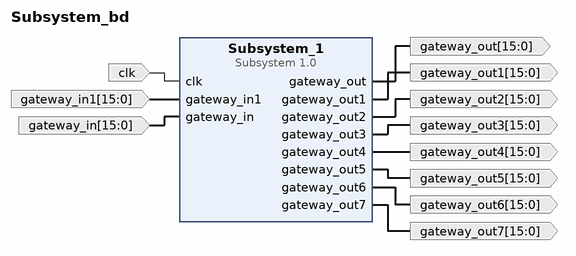
[diagram p0: block diagram of the top level]
# Vivado block design Subsystem_bd, xc7k160tfbg676-3, Vivado 2022.2
create_bd_design Subsystem_bd

create_bd_port -dir I -type clk clk
create_bd_port -dir I -from 15 -to 0 -type data gateway_in
create_bd_port -dir I -from 15 -to 0 -type data gateway_in1
create_bd_port -dir O -from 15 -to 0 -type data gateway_out
create_bd_port -dir O -from 15 -to 0 -type data gateway_out1
create_bd_port -dir O -from 15 -to 0 -type data gateway_out2
create_bd_port -dir O -from 15 -to 0 -type data gateway_out3
create_bd_port -dir O -from 15 -to 0 -type data gateway_out4
create_bd_port -dir O -from 15 -to 0 -type data gateway_out5
create_bd_port -dir O -from 15 -to 0 -type data gateway_out6
create_bd_port -dir O -from 15 -to 0 -type data gateway_out7

create_bd_cell -type ip -vlnv User_Company:VMC:Subsystem:1.0 Subsystem_1

# ---- connections ----

connect_bd_net [get_bd_pins Subsystem_1/gateway_out] [get_bd_ports gateway_out]
connect_bd_net [get_bd_pins Subsystem_1/gateway_out1] [get_bd_ports gateway_out1]
connect_bd_net [get_bd_pins Subsystem_1/gateway_out2] [get_bd_ports gateway_out2]
connect_bd_net [get_bd_pins Subsystem_1/gateway_out3] [get_bd_ports gateway_out3]
connect_bd_net [get_bd_pins Subsystem_1/gateway_out4] [get_bd_ports gateway_out4]
connect_bd_net [get_bd_pins Subsystem_1/gateway_out5] [get_bd_ports gateway_out5]
connect_bd_net [get_bd_pins Subsystem_1/gateway_out6] [get_bd_ports gateway_out6]
connect_bd_net [get_bd_pins Subsystem_1/gateway_out7] [get_bd_ports gateway_out7]
connect_bd_net [get_bd_ports clk] [get_bd_pins Subsystem_1/clk]
connect_bd_net -net gateway_in1_1 [get_bd_ports gateway_in1] [get_bd_pins Subsystem_1/gateway_in1]
connect_bd_net [get_bd_ports gateway_in] [get_bd_pins Subsystem_1/gateway_in]

validate_bd_design
save_bd_design
